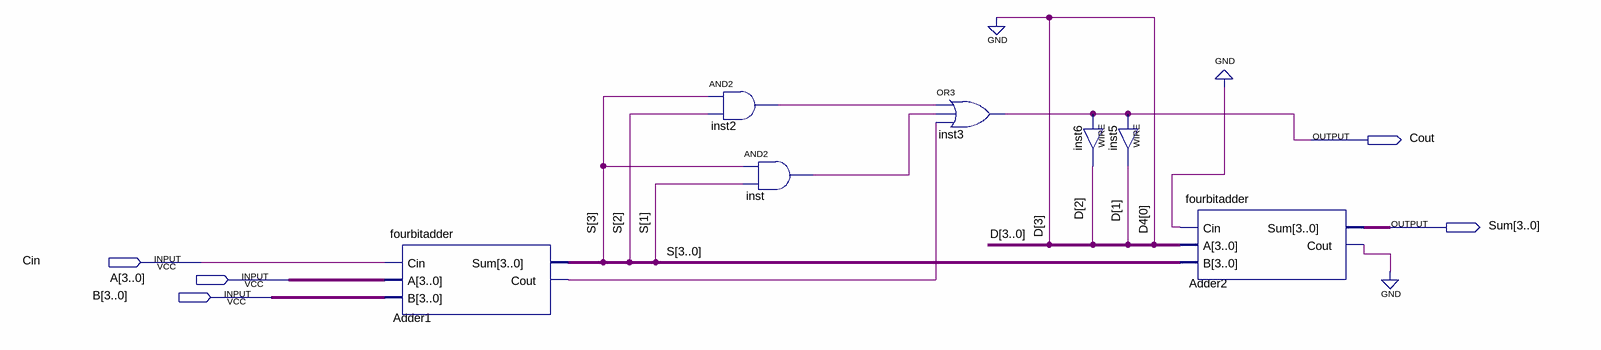
[diagram p0: schematic sheet]
// Quartus schematic SingleDigitBCDAdder.bdf as structural Verilog: 7 symbols, 5 pins
module SingleDigitBCDAdder (
  input  Cin,
  input  [3:0] A,
  input  [3:0] B,
  output Cout,
  output [3:0] Sum
);

  wire Adder1_cout, Adder2_cout, inst2_out, inst_out;
  wire [2:0] D;
  wire [3:0] S;

  fourbitadder Adder1 (.Cin(Cin), .A(A), .B(B), .Sum(S), .Cout(Adder1_cout));
  and inst2 (inst2_out, S[3], S[2]);
  and inst (inst_out, S[3], S[1]);
  or inst3 (Cout, inst2_out, inst_out, Adder1_cout);
  assign D[2] = Cout;  // WIRE inst6
  assign D[1] = Cout;  // WIRE inst5
  fourbitadder Adder2 (.Cin(1'b0), .A({1'b0, D}), .B(S), .Sum(Sum), .Cout(Adder2_cout));
  // also tied to GND on the sheet: Adder2_cout
endmodule
